# EAGLE schematic jefboard1.1 (EAGLE 9.6.2)
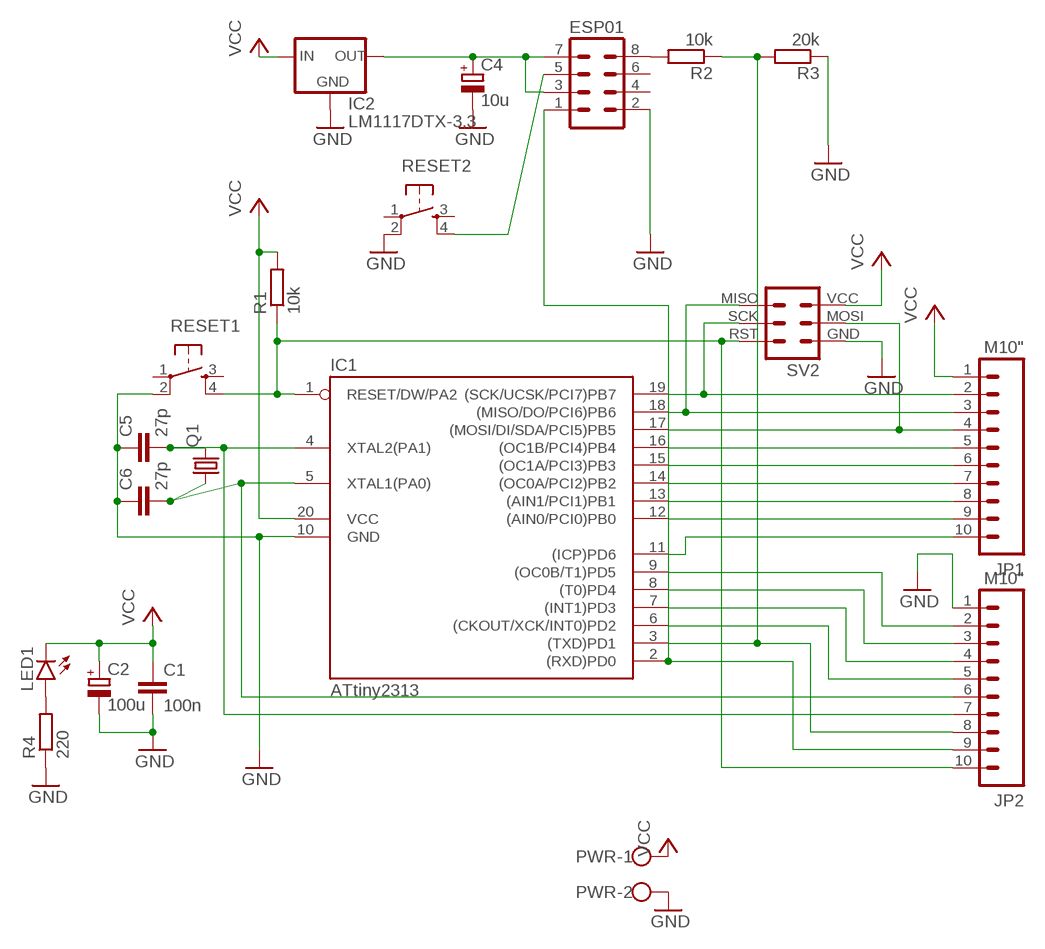
[diagram p0: schematic, sheet 1]

## Parts
C1  100n  C-EU025-025X050  [C025-025X050]
C2  100u  CPOL-EUE2.5-5  [E2,5-5]
C4  10u  CPOL-EUE2.5-5  [E2,5-5]
C5  27p  C2.5/2  [C2.5-2]
C6  27p  C2.5/2  [C2.5-2]
ESP01  MA04-2  [MA04-2]
IC1  ATtiny2313  ATTINY2313-20P  [DIL20]
IC2  LM1117DTX-3.3  [TO252]
JP1  M10"  [1X10]
JP2  M10"  [1X10]
LED1  LED3MM  [LED3MM]
PWR  W237-102  [W237-102]
Q1  CRYSTALHC49S  [HC49/S]
R1  10k  R-EU_0207/5V  [0207/5V]
R2  10k  R-EU_0207/5V  [0207/5V]
R3  20k  R-EU_0207/5V  [0207/5V]
R4  220  R-EU_0207/5V  [0207/5V]
RESET1  TAC_SWITCHPTH  [TACTILE-PTH]
RESET2  TAC_SWITCHPTH  [TACTILE-PTH]
SV2  MA03-2  [MA03-2]

## Nets
GND: C1.2 C2.- C4.- C5.1 C6.1 ESP01.2 IC1.10(GND) IC2.1(GND) JP2.1 PWR.2 R3.1 R4.1 RESET1.2 RESET2.2 SV2.GND
N$1: C4.+ ESP01.3 ESP01.7 IC2.TAB(OUT)
N$2: C5.2 IC1.4(XTAL2(PA1)) JP2.7 Q1.2
N$3: C6.2 IC1.5(XTAL1(PA0)) JP2.6 Q1.1
N$4: IC1.1(RESET/DW/PA2) JP2.10 R1.1 RESET1.4 SV2.RST
N$5: IC1.19((SCK/UCSK/PCI7)PB7) JP1.2 SV2.SCK
N$6: IC1.18((MISO/DO/PCI6)PB6) JP1.3 SV2.MISO
N$7: IC1.17((MOSI/DI/SDA/PCI5)PB5) JP1.4 SV2.MOSI
N$8: IC1.16((OC1B/PCI4)PB4) JP1.5
N$9: IC1.15((OC1A/PCI3)PB3) JP1.6
N$10: IC1.14((OC0A/PCI2)PB2) JP1.7
N$11: IC1.13((AIN1/PCI1)PB1) JP1.8
N$12: IC1.12((AIN0/PCI0)PB0) JP1.9
N$13: IC1.11((ICP)PD6) JP1.10
N$14: IC1.9((OC0B/T1)PD5) JP2.2
N$15: IC1.8((T0)PD4) JP2.3
N$16: IC1.7((INT1)PD3) JP2.4
N$17: IC1.6((CKOUT/XCK/INT0)PD2) JP2.5
N$18: IC1.3((TXD)PD1) JP2.8 R2.1 R3.2
N$19: ESP01.5 RESET2.4
N$20: ESP01.8 R2.2
N$22: LED1.A R4.2
RX: ESP01.1 IC1.2((RXD)PD0) JP2.9
VCC: C1.1 C2.+ IC1.20(VCC) IC2.2(IN) JP1.1 LED1.K(C) PWR.1 R1.2 SV2.VCC
Unconnected: ESP01.4 ESP01.6 RESET1.1 RESET1.3 RESET2.1 RESET2.3

## Library data of the parts
C1 = rcl:C-EU: CAPACITOR, European symbol; SPICEPREFIX: C
C2 C4 = rcl:CPOL-EU: POLARIZED CAPACITOR, European symbol; SPICEPREFIX: C
C5 C6 = capacitor-wima:C: CAPACITOR naming: grid - package width
ESP01 = con-lstb:MA04-2: PIN HEADER; OC_FARNELL: unknown; OC_NEWARK: unknown
IC1 = avr:ATTINY2313: MICROCONTROLLER 2 Kbytes FLASH 128 bytes SRAM 128 bytes EEPROM USART USI
IC2 = lm1117:LM1117DTX-*
JP1 JP2 = SparkFun:M10: Header 10 Standard 10-pin 0.1" header. Use with straight break away headers (SKU : PRT-00116), right angle break away headers (PRT-00553), swiss pins (PRT-00743), machine pins (PRT-00117), and female headers (PRT-00115).
LED1 = led:LED: LED OSRAM: - CHIPLED LG R971, LG N971, LY N971, LG Q971, LY Q971, LO R971, LY R971 LH N974, LH R974 LS Q976, LO Q976, LY Q976 LO Q996 - Hyper CHIPLED LW Q18S LB Q993, LB Q99A, LB R99A - SideLED LS A670, LO A670, LY A670, LG A670, LP A670 LB A673, LV A673, LT A673, LW A673 LH A674 LY A675 LS A676, LA A676, LO A676, LY A676, LW A676 LS A679, LY A679, LG A679 - Hyper Micro SIDELED® LS Y876, LA Y876, LO Y876, LY Y876 LT Y87S - SmartLED LW L88C, LW L88S LB L89C, LB L89S, LG L890 LS L89K, LO L89K, LY L89K LS L896, LA L896, LO L896, LY L896 - TOPLED LS T670, LO T670, LY T670, LG T670, LP T670 LSG T670, LSP T670, LSY T670, LOP T670, LYG T670 LG T671, LOG T671, LSG T671 LB T673, LV T673, LT T673, LW T673 LH T674 LS T676, LA T676, LO T676, LY T676, LB T676, LH T676, LSB T676, LW T676 LB T67C, LV T67C, LT T67C, LS T67K, LO T67K, LY T67K, LW E67C LS E67B, LA E67B, LO E67B, LY E67B, LB E67C, LV E67C, LT E67C LW T67C LS T679, LY T679, LG T679 LS T770, LO T770, LY T770, LG T770, LP T770 LB T773, LV T773, LT T773, LW T773 LH T774 LS E675, LA E675, LY E675, LS T675 LS T776, LA T776, LO T776, LY T776, LB T776 LHGB T686 LT T68C, LB T68C - Hyper Mini TOPLED® LB M676 - Mini TOPLED Santana® LG M470 LS M47K, LO M47K, LY M47K Source: http://www.osram.convergy.de LUXEON: - LUMILED® LXK2-PW12-R00, LXK2-PW12-S00, LXK2-PW14-U00, LXK2-PW14-V00 LXK2-PM12-R00, LXK2-PM12-S00, LXK2-PM14-U00 LXK2-PE12-Q00, LXK2-PE12-R00, LXK2-PE12-S00, LXK2-PE14-T00, LXK2-PE14-U00 LXK2-PB12-K00, LXK2-PB12-L00, LXK2-PB12-M00, LXK2-PB14-N00, LXK2-PB14-P00, LXK2-PB14-Q00 LXK2-PR12-L00, LXK2-PR12-M00, LXK2-PR14-Q00, LXK2-PR14-R00 LXK2-PD12-Q00, LXK2-PD12-R00, LXK2-PD12-S00 LXK2-PH12-R00, LXK2-PH12-S00 LXK2-PL12-P00, LXK2-PL12-Q00, LXK2-PL12-R00 Source: www.luxeon.com KINGBRIGHT: KA-3528ASYC Source: www.kingbright.com
PWR = con-wago-500:W237-102: WAGO SCREW CLAMP; MPN: 237-102; OC_FARNELL: unknown; OC_NEWARK: 70K9898
Q1 = crystal:CRYSTAL: CRYSTAL; OC_FARNELL: 1667008; OC_NEWARK: unknown
R1-R4 = rcl:R-EU_: RESISTOR, European symbol; SPICEPREFIX: R
RESET1 RESET2 = SparkFun:TAC_SWITCH: Momentary Switch Button commonly used for reset or general input. Spark Fun Electronics SKU : COM-00097
SV2 = alex:MA03-2: PIN HEADER